# Altium schematic sheet EJ8_LOGIC_SCH.SchDoc
size A
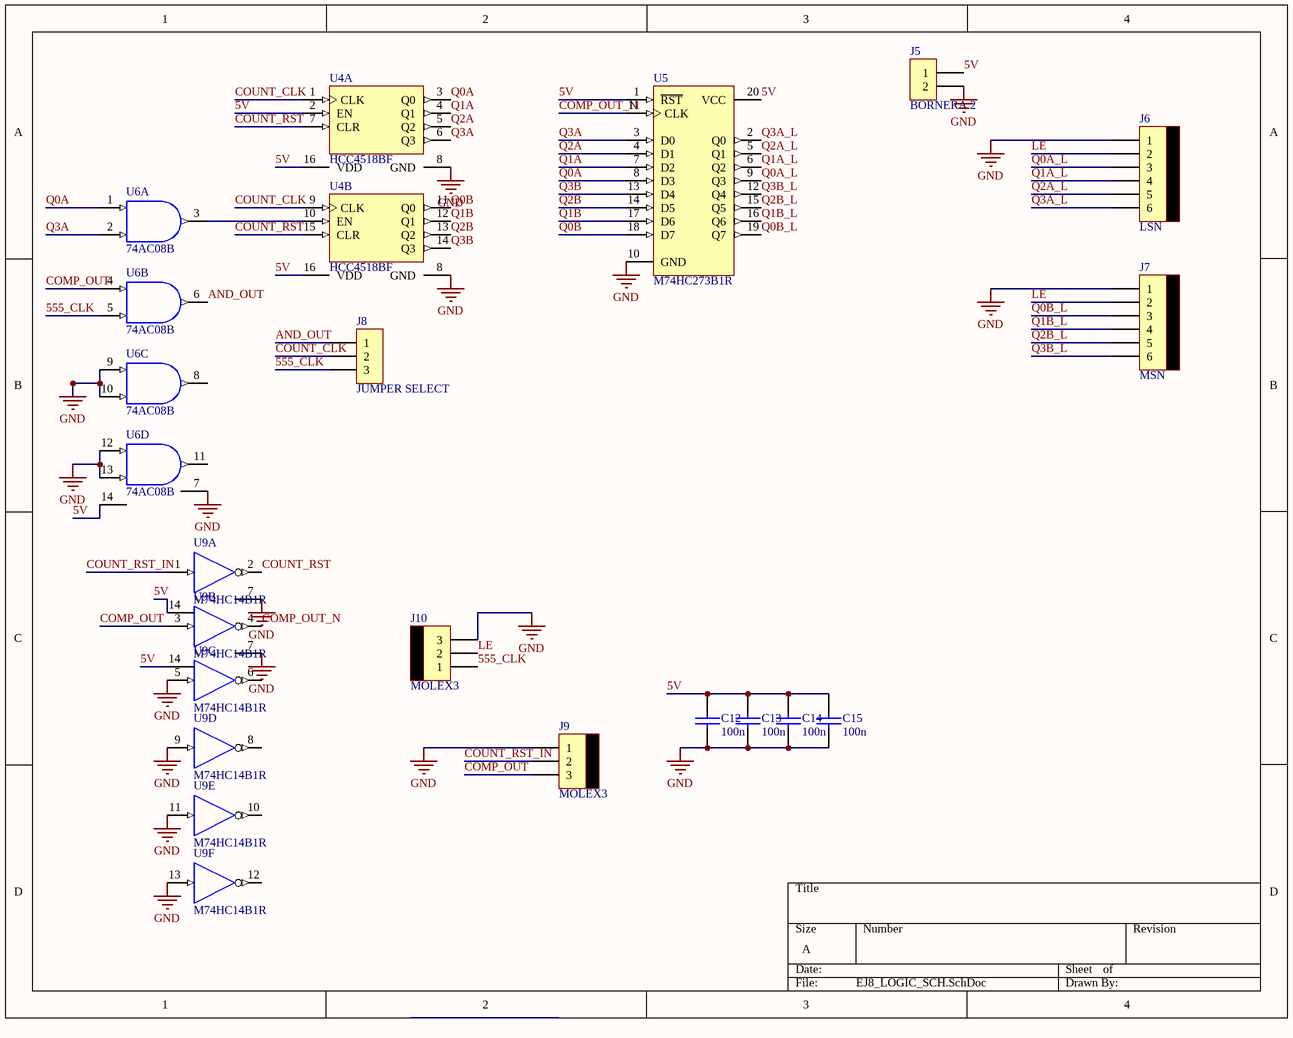
[diagram p0: EJ8_LOGIC_SCH.SchDoc]

## Parts
C12  100n  [0805]
C13  100n  [0805]
C14  100n  [0805]
C15  100n  [0805]
J5  BORNERA 2  [BORNERA2]
J6  LSN  [MOLEX6]
J7  MSN  [MOLEX6]
J8  JUMPER SELECT  [SIP3]
J9  MOLEX3  [MOLEX3]
J10  MOLEX3  [MOLEX3]
U4  HCC4518BF  [DIP16]  (parts A,B of 2)
U5  M74HC273B1R  [DIP20]
U6  74AC08B  [DIP14]  (parts A,B,C,D of 4)
U9  M74HC14B1R  [DIP14]  (parts A,B,C,D,E,F of 6)

## Nets
5V: C12.1 C13.1 C14.1 C15.1 J5.1 U4.2(EN) U4.16(VDD) U5.1(~{RST}) U5.20(VCC) U6.14(VCC) U9.14(VCC)  [also labelled VCC, VDD]
GND: C12.2 C13.2 C14.2 C15.2 J5.2 J6.1 J7.1 J9.1 J10.3 U4.8(GND) U5.10(GND) U6.7(GND) U6.9(A) U6.10(B) U6.12(A) U6.13(B) U9.5(A) U9.7(GND) U9.9(A) U9.11(A) U9.13(A)
555_CLK: J8.3 J10.1 U6.5(B)
AND_OUT: J8.1 U6.6(Y)
COMP_OUT: J9.3 U6.4(A) U9.3(A)
COMP_OUT_N: U5.11(CLK) U9.4(Y)
COUNT_CLK: J8.2 U4.1(CLK) U4.9(CLK)
COUNT_RST: U4.7(CLR) U4.15(CLR) U9.2(Y)
COUNT_RST_IN: J9.2 U9.1(A)
LE: J6.2 J7.2 J10.2
Q0A: U4.3(Q0) U5.8(D3) U6.1(A)
Q0A_L: J6.3 U5.9(Q3)
Q0B: U4.11(Q0) U5.18(D7)
Q0B_L: J7.3 U5.19(Q7)
Q1A: U4.4(Q1) U5.7(D2)
Q1A_L: J6.4 U5.6(Q2)
Q1B: U4.12(Q1) U5.17(D6)
Q1B_L: J7.4 U5.16(Q6)
Q2A: U4.5(Q2) U5.4(D1)
Q2A_L: J6.5 U5.5(Q1)
Q2B: U4.13(Q2) U5.14(D5)
Q2B_L: J7.5 U5.15(Q5)
Q3A: U4.6(Q3) U5.3(D0) U6.2(B)
Q3A_L: J6.6 U5.2(Q0)
Q3B: U4.14(Q3) U5.13(D4)
Q3B_L: J7.6 U5.12(Q4)
NetU4_10: U4.10(EN) U6.3(Y)

Not connected (* = marked no-connect by the designer): U6 8(Y) 11(Y); U9 6(Y) 8(Y) 10(Y) 12(Y)

## Library data of the parts
C12-C15 = CAP
J6 J7 = MOLEX6
J8 = CON3
U4 = HCC4518BF: Dual Decade Up-Counter; Published: 8-Jun-2000; LatestRevisionDate: 06-Jun-2005; LatestRevisionNote: Stylized 3D Model Added.; DatasheetVersion: Jun-1989; PackageVersion: Apr-1996; PackageReference: DIP16; Publisher: Altium Limited; PackageDescription: DIP; 16 Leads; Row Spacing 7.62 mm; Pitch 2.54 mm; ComponentLink1Description: Manufacturer Link; ComponentLink1URL: http://www.st.com/
U5 = M74HC273B1R: Octal D-Type Flip-Flop with Clear; Published: 8-Jun-2000; LatestRevisionDate: 06-Jun-2005; LatestRevisionNote: Stylized 3D Model Added.; DatasheetVersion: Oct-1992; PackageVersion: Jun-1998; PackageReference: DIP20; Publisher: Altium Limited; PackageDescription: DIP; 20 Leads; Row Spacing 7.62 mm; Pitch 2.54 mm; Code_JEDEC: MS-015-AE; ComponentLink1Description: Manufacturer Link; ComponentLink1URL: http://www.st.com/; ComponentLink2Description: Datasheet; ComponentLink2URL: http://www.st.com/stonline/products/literature/ds/1936/m74hc273.pdf
U6 = 74AC08B: Quad 2-Input AND Gate; Published: 8-Jun-2000; LatestRevisionDate: 06-Jun-2005; LatestRevisionNote: Stylized 3D Model Added.; DatasheetVersion: Apr-1997; PackageVersion: Jan-1997; PackageReference: DIP14; Publisher: Altium Limited; PackageDescription: DIP; 14 Leads; Row Spacing 7.62 mm; Pitch 2.54 mm; ComponentLink1Description: Manufacturer Link; ComponentLink1URL: http://www.st.com/; ComponentLink2Description: Datasheet; ComponentLink2URL: http://www.st.com/stonline/products/literature/ds/4694/74ac08.pdf
U9 = M74HC14B1R: Hex Schmitt Inverter; Published: 8-Jun-2000; LatestRevisionDate: 06-Jun-2005; LatestRevisionNote: Stylized 3D Model Added.; DatasheetVersion: Dec-1992; PackageVersion: Jan-1997; PackageReference: DIP14; Publisher: Altium Limited; PackageDescription: DIP; 14 Leads; Row Spacing 7.62 mm; Pitch 2.54 mm; ComponentLink1Description: Manufacturer Link; ComponentLink1URL: http://www.st.com/; ComponentLink2Description: Datasheet; ComponentLink2URL: http://www.st.com/stonline/products/literature/ds/1901/m74hc14.pdf